# Altium schematic sheet RTC_DS1307.SchDoc
size A4
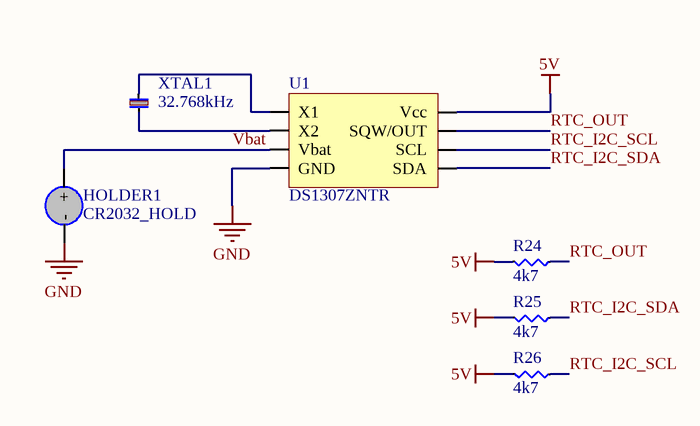
[diagram p0: RTC_DS1307.SchDoc]

## Parts
HOLDER1  CR2032_HOLD  [BATTERYHOLDER_2032]
R24  4k7  [R_0805]
R25  4k7  [R_0805]
R26  4k7  [R_0805]
U1  DS1307ZNTR  [SOP8]
XTAL1  32.768kHz  [CRYSTAL_CYLINDER]

## Nets
5V: R24.2 R25.2 R26.2 U1.8(Vcc)
GND: HOLDER1.2(-) U1.4(GND)
RTC_I2C_SCL: R26.1 U1.6(SCL)
RTC_I2C_SDA: R25.1 U1.5(SDA)
RTC_OUT: R24.1 U1.7(SQW/OUT)
Vbat: HOLDER1.1(+) U1.3(Vbat)
NetU1_1: U1.1(X1) XTAL1.2
NetU1_2: U1.2(X2) XTAL1.1

## Library data of the parts
HOLDER1 = BS-7: BATTERY HOLDER COIN 20MM PC PIN; Manufacturer: Memory Protection Devices; Number of Cells: 1; Supplier 1: Digi-Key; Manufacturer Part Number: BS-7; Stock 1: 32964; Pricing 1: 1 = 0,78000, 10 = 0,66000, 50 = 0,57880, 100 = 0,54570, 250 = 0,50236, 500 = 0,47176, 1000 = 0,44115, 2500 = 0,40290, 5000 = 0,37230 (USD); RoHS: Yes; Mount: Through Hole,PCB; Min Operating Temperature: -55°C; Max Operating Temperature: 105°C; Package Quantity: 100; Termination: PC Pin; Diameter: 20mm; Lead Free: Lead Free; ComponentLink1URL: https://datasheet.ciiva.com/3/bs-7-datasheet-3824.pdf?src-supplier=Digi-Key; ComponentLink1Description: https://datasheet.ciiva.com/3/bs-7-datasheet-3824.pdf?src-supplier=Digi-Key; Supplier Part Number 1: BS-7-ND
R24-R26 = RC0805JR-074K7L: RES SMD 4.7K OHM 5% 1/8W 0805; Manufacturer: Yageo; Resistance: 4.7kR; Temperature Coefficient: 100ppm/°C; Power Rating: 125mW; Voltage Rating: 150V; Supplier 1: Digi-Key; Manufacturer Part Number: RC0805JR-074K7L; Stock 1: 4531065; Pricing 1: 1=0.1, 10=0.036, 100=0.0146, 1000=0.00654, 2500=0.00568 (USD); Case/Package: Molded; Contact Plating: Lead,Matte,Tin; Case Code (Imperial): 0805; Case Code (Metric): 2012; Min Operating Temperature: -55°C; Max Operating Temperature: 155°C; Tolerance: 5%; Composition: Thick Film; Packaging: Tape and Reel; Termination: SMD/SMT; Military Standard: Not; Length: 2mm; Depth: 1.25mm; Radiation Hardening: No; REACH SVHC: Unknown; Lead Free: Lead Free; ComponentLink1URL: http://www.farnell.com/datasheets/442941.pdf?src-supplier=Element14; ComponentLink1Description: http://www.farnell.com/datasheets/442941.pdf?src-supplier=Element14; ComponentLink2URL: http://www.yageo.ru/pdf/RC0805.pdf?src-supplier=Future+Electronics; ComponentLink2Description: http://www.yageo.ru/pdf/RC0805.pdf?src-supplier=Future+Electronics; ComponentLink3URL: http://www.mouser.com/ds/2/447/Yageo_08112016_RC0805-968729.pdf?src-supplier=Mouser; ComponentLink3Description: http://www.mouser.com/ds/2/447/Yageo_08112016_RC0805-968729.pdf?src-supplier=Mouser; Supplier Part Number 1: 311-4.7KARDKR-ND
U1 = DS1307ZNTR: IC RTC CLK/CALENDAR I2C 8-SOIC; Manufacturer: Maxim; Max Supply Voltage: 5.5V; Min Supply Voltage: 4.5V; Interface: I2C,Serial,2-Wire; Memory Size: 56B; Logic Function: Clock; Voltage: 7V; Time Format: HH:MM:SS; Date Format: YY-MM-DD-dd; Operating Supply Voltage: 5V; Supplier 1: Digi-Key; Manufacturer Part Number: DS1307ZNTR; Stock 1: 0; RoHS: Yes; Mount: Surface Mount; Case/Package: SOIC; Number of Pins: 8; Weight: 0.019048oz; Contact Plating: Tin,Matte; Min Operating Temperature: -40°C; Max Operating Temperature: 85°C; Packaging: Tape and Reel; Package Quantity: 2500; Radiation Hardening: No; Lead Free: Lead Free; REACH SVHC: Unknown; ComponentLink1URL: https://datasheet.ciiva.com/1243/ds1307-1243264.pdf?src-supplier=Digi-Key; ComponentLink1Description: https://datasheet.ciiva.com/1243/ds1307-1243264.pdf?src-supplier=Digi-Key; ComponentLink2URL: https://datasheet.ciiva.com/28652/1647366-28652551.pdf?src-supplier=Element14; ComponentLink2Description: https://datasheet.ciiva.com/28652/1647366-28652551.pdf?src-supplier=Element14; ComponentLink3URL: https://datasheet.ciiva.com/18633/ds1307-18633131.pdf?src-supplier=Digi-Key; ComponentLink3Description: https://datasheet.ciiva.com/18633/ds1307-18633131.pdf?src-supplier=Digi-Key; ComponentLink4URL: https://datasheet.ciiva.com/3304/ds1307-3304460.pdf?src-supplier=Avnet; ComponentLink4Description: https://datasheet.ciiva.com/3304/ds1307-3304460.pdf?src-supplier=Avnet; ComponentLink5URL: https://datasheet.ciiva.com/18633/ds1307-18633132.pdf?src-supplier=Digi-Key; ComponentLink5Description: https://datasheet.ciiva.com/18633/ds1307-18633132.pdf?src-supplier=Digi-Key; Supplier Part Number 1: DS1307ZN+T&RTR-ND
XTAL1 = ECS-3X8X: CRYSTAL 32.7680KHZ 12.5PF T/H; Manufacturer: ECS International; Tolerance: 20ppm; ESR (Equivalent Series Resistance): 35kR; Supplier 1: Digi-Key; Manufacturer Part Number: ECS-3X8X; Stock 1: 7563; Pricing 1: 1 = 0,270000, 10 = 0,224000, 50 = 0,202000, 100 = 0,179500, 500 = 0,170560, 1000 = 0,143630, 2500 = 0,134660, 5000 = 0,130170, 10000 = 0,125680 (USD); RoHS: Yes; Mount: Through Hole; Case/Package: Radial; Min Operating Temperature: -10°C; Max Operating Temperature: 60°C; Termination: Radial; Package Quantity: 1000; Packaging: Bulk; Frequency: 32.768kHz; Frequency Tolerance: 20ppm; Load Capacitance: 12.5pF; Diameter: 3.1mm; Length: 0.323inch; Height: 0.323inch; Lead Free: Lead Free; ComponentLink1URL: https://datasheet.ciiva.com/852/ecs-3x8x2x6x1x5x-852748.pdf?src-supplier=Digi-Key; ComponentLink1Description: https://datasheet.ciiva.com/852/ecs-3x8x2x6x1x5x-852748.pdf?src-supplier=Digi-Key; Supplier Part Number 1: X1123-ND